# EAGLE design sim_reader (EAGLE 6.6.0)
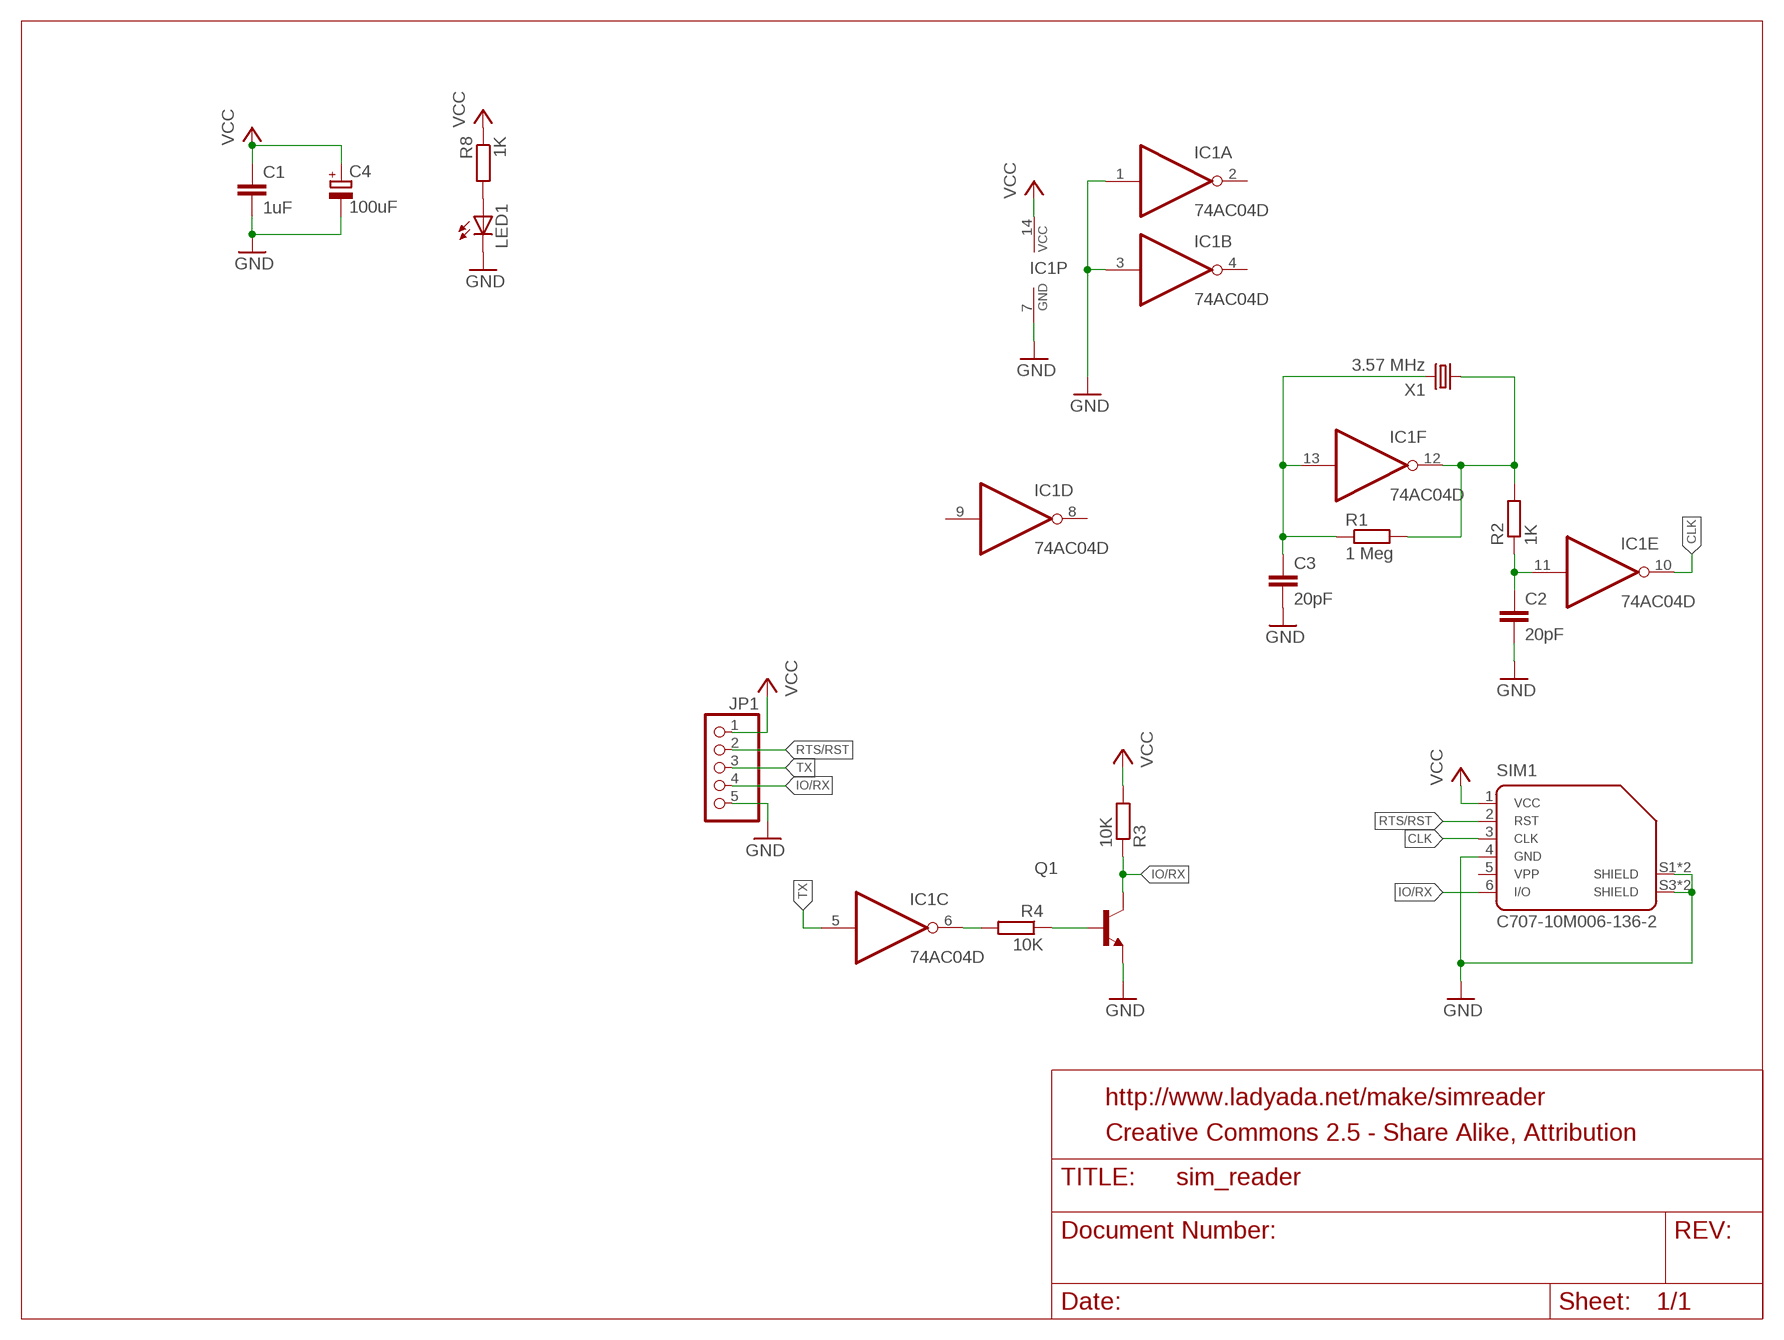
[diagram p0: schematic, sheet 1]

## Parts
C1  1uF  C-EUC0805  [C0805]
C2  20pF  C-EUC0805  [C0805]
C3  20pF  C-EUC0805  [C0805]
C4  100uF  CPOL-EU140CLH-0810  [140CLH-0810]
IC1  74AC04D  [SO14]
JP1  PINHD-1X5  [1X05]
LED1  LEDCHIPLED_0805  [CHIPLED_0805]
Q1  BC808-NPN-SOT23-BEC  [SOT23-BEC]
R1  1 Meg  R-EU_R0805  [R0805]
R2  1K  R-EU_R0805  [R0805]
R3  10K  R-EU_R0805  [R0805]
R4  10K  R-EU_R0805  [R0805]
R8  1K  R-EU_R0805  [R0805]
SIM1  C707-10M006-136-2  [C707_10M006_136_2]
X1  3.57 MHz  CRYSTALHC49UP  [HC49UP]

## Nets
CLK: IC1.10(E:O) SIM1.3
GND: C1.2 C2.2 C3.2 C4.- IC1.1(A:I) IC1.3(B:I) IC1.7(P:GND) JP1.5 LED1.C Q1.E SIM1.4 SIM1.S1 SIM1.S2(S1) SIM1.S3(S2) SIM1.S4(S2)
IO/RX: JP1.4 Q1.C R3.1 SIM1.6
N$1: C3.1 IC1.13(F:I) R1.1 X1.2
N$2: IC1.12(F:O) R1.2 R2.2 X1.1
N$3: C2.1 IC1.11(E:I) R2.1
N$4: IC1.6(C:O) R4.2
N$6: Q1.B R4.1
N$13: LED1.A R8.2
RTS/RST: JP1.2 SIM1.2
TX: IC1.5(C:I) JP1.3
VCC: C1.1 C4.+ IC1.14(P:VCC) JP1.1 R3.2 R8.1 SIM1.1
Unconnected: IC1.2(A:O) IC1.4(B:O) IC1.8(D:O) IC1.9(D:I) SIM1.5

## Notes on the sheet
- http://www.ladyada.net/make/simreader
- Creative Commons 2.5 - Share Alike, Attribution

## Library data of the parts
C1-C3 = rcl:C-EU: CAPACITOR, European symbol
C4 = rcl:CPOL-EU: POLARIZED CAPACITOR, European symbol
IC1 = 74xx-eu:74*04: Hex INVERTER
JP1 = smd_pinhead:PINHD-1X5: PIN HEADER
LED1 = led:LED: LED OSRAM: - CHIPLED LG R971, LG N971, LY N971, LG Q971, LY Q971, LO R971, LY R971 LH N974, LH R974 LS Q976, LO Q976, LY Q976 LO Q996 - Hyper CHIPLED LW Q18S LB Q993, LB Q99A, LB R99A - SideLED LS A670, LO A670, LY A670, LG A670, LP A670 LB A673, LV A673, LT A673, LW A673 LH A674 LY A675 LS A676, LA A676, LO A676, LY A676, LW A676 LS A679, LY A679, LG A679 - Hyper Micro SIDELED® LS Y876, LA Y876, LO Y876, LY Y876 LT Y87S - SmartLED LW L88C, LW L88S LB L89C, LB L89S, LG L890 LS L89K, LO L89K, LY L89K LS L896, LA L896, LO L896, LY L896 - TOPLED LS T670, LO T670, LY T670, LG T670, LP T670 LSG T670, LSP T670, LSY T670, LOP T670, LYG T670 LG T671, LOG T671, LSG T671 LB T673, LV T673, LT T673, LW T673 LH T674 LS T676, LA T676, LO T676, LY T676, LB T676, LH T676, LSB T676, LW T676 LB T67C, LV T67C, LT T67C, LS T67K, LO T67K, LY T67K, LW E67C LS E67B, LA E67B, LO E67B, LY E67B, LB E67C, LV E67C, LT E67C LW T67C LS T679, LY T679, LG T679 LS T770, LO T770, LY T770, LG T770, LP T770 LB T773, LV T773, LT T773, LW T773 LH T774 LS E675, LA E675, LY E675, LS T675 LS T776, LA T776, LO T776, LY T776, LB T776 LHGB T686 LT T68C, LB T68C - Hyper Mini TOPLED® LB M676 - Mini TOPLED Santana® LG M470 LS M47K, LO M47K, LY M47K Source: http://www.osram.convergy.de LUXEON: - LUMILED® LXK2-PW12-R00, LXK2-PW12-S00, LXK2-PW14-U00, LXK2-PW14-V00 LXK2-PM12-R00, LXK2-PM12-S00, LXK2-PM14-U00 LXK2-PE12-Q00, LXK2-PE12-R00, LXK2-PE12-S00, LXK2-PE14-T00, LXK2-PE14-U00 LXK2-PB12-K00, LXK2-PB12-L00, LXK2-PB12-M00, LXK2-PB14-N00, LXK2-PB14-P00, LXK2-PB14-Q00 LXK2-PR12-L00, LXK2-PR12-M00, LXK2-PR14-Q00, LXK2-PR14-R00 LXK2-PD12-Q00, LXK2-PD12-R00, LXK2-PD12-S00 LXK2-PH12-R00, LXK2-PH12-S00 LXK2-PL12-P00, LXK2-PL12-Q00, LXK2-PL12-R00 Source: www.luxeon.com KINGBRIGHT: KA-3528ASYC Source: www.kingbright.com
Q1 = transistor:*-NPN-: NPN Transistror BF959 corrected 2008.03.06
R1-R4 R8 = rcl:R-EU_: RESISTOR, European symbol
SIM1 = con-amphenol:C707-10M006-136-2
X1 = crystal:CRYSTAL: CRYSTAL; OC_FARNELL: unknown; OC_NEWARK: unknown

## Board
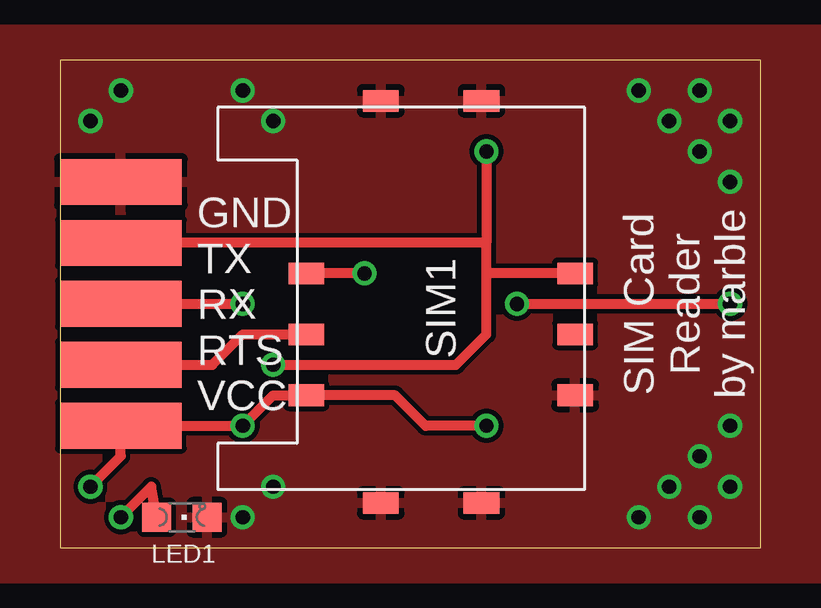
[diagram p1: board, top side]
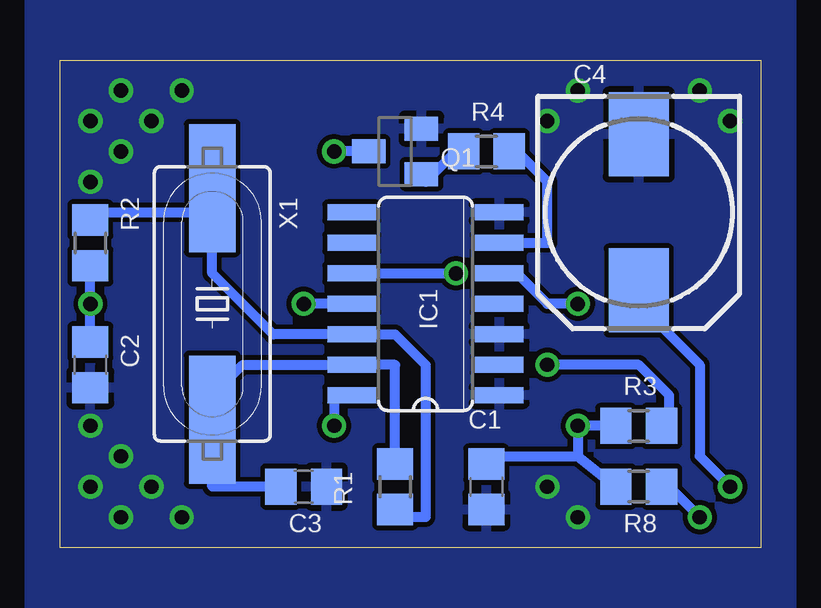
[diagram p2: board, bottom side, seen from below]

Size 29.21 x 20.32 mm. Coordinates in mm from the lower left corner, seen from the top.
Outline: 0,0 29.21,0 29.21,20.32 0,20.32 0,0
Copper layers (1*16): Top 0.035mm / dielectric 1.5mm / Bottom 0.035mm
Design rules "default *": minimum track width 10mil, minimum drill 23mil, track to track 8mil, track to pad 8mil, pad to pad 8mil, via to via 8mil, smd to smd 8mil, copper to edge 0mil, drill to drill 8mil, minimum pad ring 10mil, minimum via ring 8mil, stop-mask expansion 4mil, vias tented up to drill 0mil, thermal gap 10mil

### Footprints (pad centres in the part's own frame; a part is rotated, then mirrored left to right if it is on the bottom)
C0805 = smd 1.3 x 1.5: 1 -0.95,0; 2 0.95,0
140CLH-0810 = smd 3.5 x 2.5: + 3.25,0; - -3.25,0
SO14 = smd 0.66 x 2.032: 1 -3.81,-3.073; 2 -2.54,-3.073; 3 -1.27,-3.073; 4 0,-3.073; 5 1.27,-3.073; 6 2.54,-3.073; 7 3.81,-3.073; 8 3.81,3.073; 9 2.54,3.073; 10 1.27,3.073; 11 0,3.073; 12 -1.27,3.073; 13 -2.54,3.073; 14 -3.81,3.073
1X05 = smd 1.905 x 5.08: 1 -5.08,0; 2 -2.54,0; 3 0,0; 4 2.54,0; 5 5.08,0
CHIPLED_0805 = smd 1.2 x 1.2: A 0,-1.05; C 0,1.05
SOT23-BEC = smd 1 x 1.4: B -0.95,-1.1; C 0,1.1; E 0.95,-1.1
R0805 = smd 1.3 x 1.5: 1 -0.95,0; 2 0.95,0
C707_10M006_136_2 = smd 1.49 x 0.9: 1 4.965,2.54; 2 4.965,0; 3 4.965,-2.54; 4 -6.235,2.54; 5 -6.235,0; 6 -6.235,-2.54; S1 -2.335,7.02; S2 1.865,7.02; S3 -2.335,-9.73; S4 1.865,-9.73
HC49UP = smd 5.334 x 1.93: 1 -4.826,0; 2 4.826,0

### Placement (x,y rotation side)
C1  11.43,2.54 270 bottom
C2  27.94,7.62 270 bottom
C3  19.05,2.54 0 bottom
C4  5.08,13.97 270 bottom
IC1  13.97,10.16 90 bottom
JP1  2.54,10.16 90 top
LED1  5.08,1.27 270 top
Q1  15.24,16.51 90 bottom
R1  15.24,2.54 270 bottom
R2  27.94,12.7 90 bottom
R3  5.08,5.08 180 bottom
R4  11.43,16.51 0 bottom
R8  5.08,2.54 0 bottom
SIM1  15.24,8.89 180 top
X1  22.86,10.16 270 bottom

### Tracks (layer width: path | path; a pad name or v marks a point on that pad's centre or on a via)
CLK  (via drill 0.6)
  Top 0.406: v12.7,11.43 SIM1.3
  Bottom 0.406: IC1.10 v12.7,11.43
GND  (via drill 0.6)
  other vias: 2.54,19.05 7.62,19.05 26.67,19.05 24.13,19.05 27.94,17.78 26.67,16.51 27.94,15.24 25.4,17.78 27.94,5.08 27.94,2.54 26.67,3.81 26.67,1.27 25.4,2.54 24.13,1.27 1.27,17.78 8.89,17.78 8.89,2.54 7.62,1.27
  pour Top: -2.54,-1.27 31.75,-1.27 31.75,21.59 -2.54,21.59
  pour Bottom: -1.27,-2.54 30.48,-2.54 30.48,22.86 -1.27,22.86
IO/RX  (via drill 0.6)
  Top 0.406: SIM1.6 17.78,11.43 | 17.78,12.7 JP1.4 | v17.78,16.51 17.78,12.7 | v8.89,7.62 16.51,7.62 17.78,8.89 17.78,11.43 | 17.78,11.43 17.78,12.7
  Bottom 0.406: Q1.C v17.78,16.51 | R3.1 3.81,5.08 3.81,6.35 5.08,7.62 v8.89,7.62
N$1
  Bottom 0.406: R1.1 15.24,7.62 IC1.13 21.59,7.62 22.86,6.35 X1.2 22.86,2.54 C3.1
N$2
  Bottom 0.406: 22.86,13.97 22.86,11.43 20.32,8.89 IC1.12 15.24,8.89 13.97,7.62 13.97,1.27 15.24,1.27 R1.2 | 22.86,13.97 X1.1 | R2.2 27.94,13.97 22.86,13.97
N$3  (via drill 0.6)
  Top 0.406: v19.05,10.16 v27.94,10.16
  Bottom 0.406: IC1.11 v19.05,10.16 | R2.1 v27.94,10.16 C2.1
N$4
  Bottom 0.406: IC1.6 8.89,12.7 8.89,15.24 10.16,16.51 R4.2
N$6
  Bottom 0.406: Q1.B 14.14,15.41 13.97,15.24 12.7,16.51 R4.1
N$13  (via drill 0.6)
  Top 0.406: LED1.A 3.81,2.54 v2.54,1.27
  Bottom 0.406: R8.2 3.81,2.54 v2.54,1.27
RTS/RST
  Top 0.406: JP1.2 6.35,7.62 7.62,8.89 SIM1.2
TX  (via drill 0.6)
  Top 0.406: JP1.3 v7.62,10.16
  Bottom 0.406: v7.62,10.16 8.89,10.16 10.16,11.43 IC1.5
VCC  (via drill 0.6)
  Top 0.406: v17.78,5.08 15.24,5.08 13.97,6.35 SIM1.1 8.89,6.35 v7.62,5.08 JP1.1 2.54,3.81 v1.27,2.54
  Bottom 0.406: IC1.14 17.78,6.35 v17.78,5.08 | C1.1 11.43,3.81 7.62,3.81 | R3.2 v7.62,5.08 7.62,3.81 | 7.62,3.81 R8.1 | C4.+ 5.08,10.16 2.54,7.62 2.54,3.81 v1.27,2.54

### Text on the board
tNames: GND / TX / RX / RTS / VCC | SIM Card / Reader / by marble